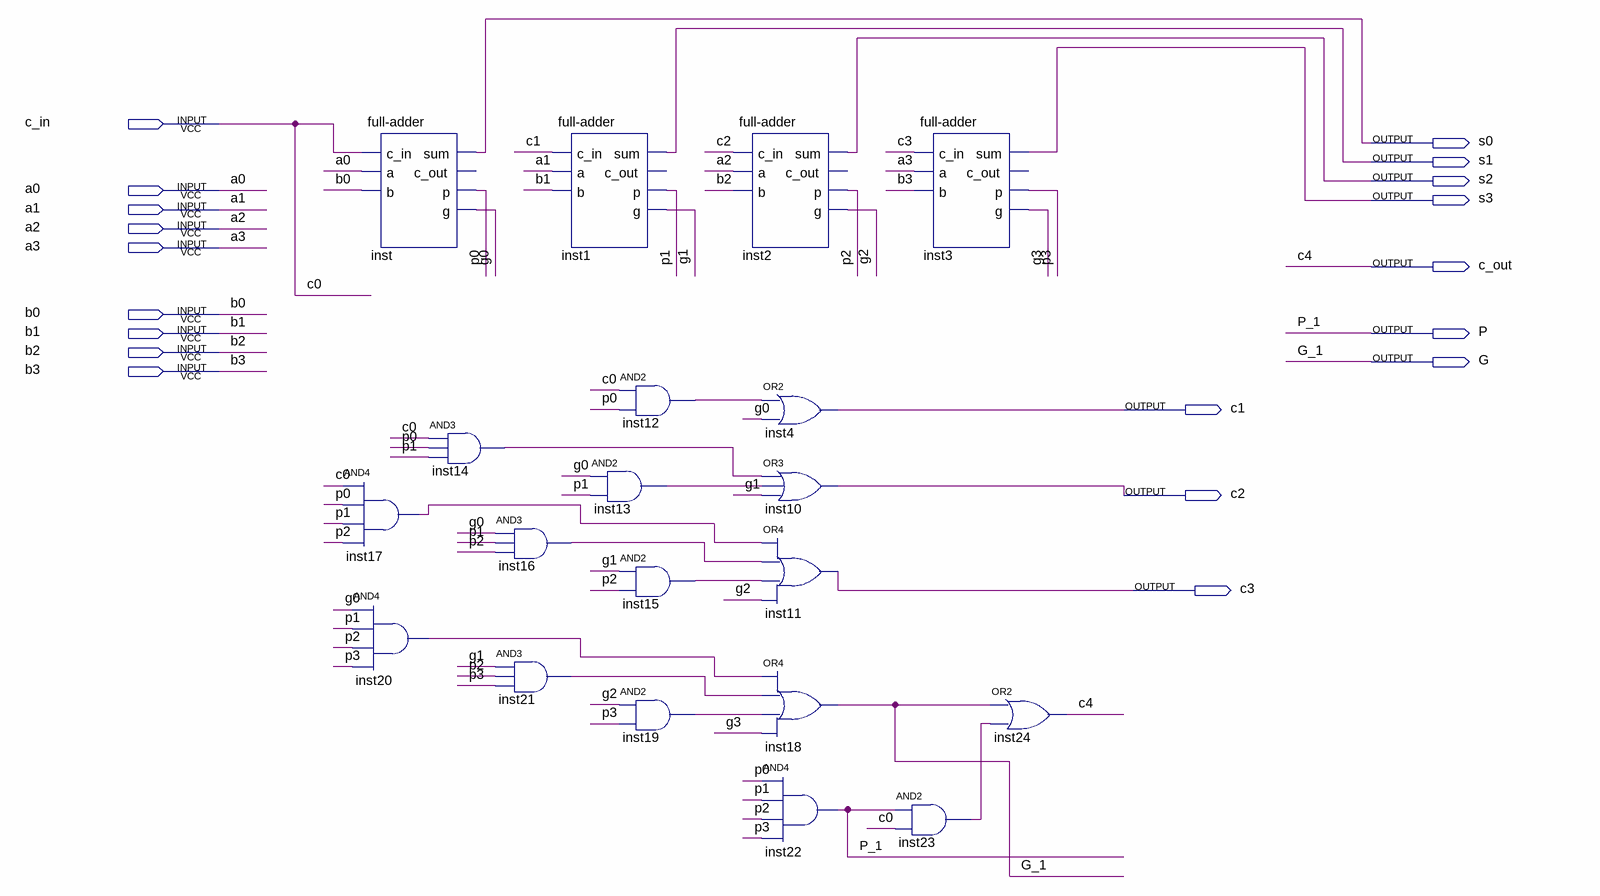
[diagram p0: schematic sheet]
// Quartus schematic Carry_Look_Ahead.bdf as structural Verilog: 20 symbols, 19 pins
module Carry_Look_Ahead (
  input  c_in,
  input  a0,
  input  a1,
  input  a2,
  input  a3,
  input  b0,
  input  b1,
  input  b2,
  input  b3,
  output s0,
  output s1,
  output s2,
  output s3,
  output c_out,
  output P,
  output G,
  output c1,
  output c2,
  output c3
);

  wire g0, g1, g2, g3, inst12_out, inst13_out, inst14_out, inst15_out, inst16_out, inst17_out, inst19_out,
       inst20_out, inst21_out, inst23_out, p0, p1, p2, p3;

  \full-adder  inst (.c_in(c_in), .a(a0), .b(b0), .sum(s0), .p(p0), .g(g0));  // open: c_out
  and inst17 (inst17_out, c_in, p0, p1, p2);
  and inst20 (inst20_out, g0, p1, p2, p3);
  and inst14 (inst14_out, c_in, p0, p1);
  and inst16 (inst16_out, g0, p1, p2);
  and inst21 (inst21_out, g1, p2, p3);
  \full-adder  inst1 (.c_in(c1), .a(a1), .b(b1), .sum(s1), .p(p1), .g(g1));  // open: c_out
  and inst12 (inst12_out, c_in, p0);
  and inst13 (inst13_out, g0, p1);
  and inst15 (inst15_out, g1, p2);
  and inst19 (inst19_out, g2, p3);
  \full-adder  inst2 (.c_in(c2), .a(a2), .b(b2), .sum(s2), .p(p2), .g(g2));  // open: c_out
  or inst4 (c1, inst12_out, g0);
  or inst10 (c2, inst14_out, inst13_out, g1);
  or inst11 (c3, inst17_out, inst16_out, inst15_out, g2);
  or inst18 (G, inst20_out, inst21_out, inst19_out, g3);
  and inst22 (P, p0, p1, p2, p3);
  \full-adder  inst3 (.c_in(c3), .a(a3), .b(b3), .sum(s3), .p(p3), .g(g3));  // open: c_out
  and inst23 (inst23_out, P, c_in);
  or inst24 (c_out, G, inst23_out);

  // Other names for the same wires on the sheet: c4 = c_out; c0 = c_in; G_1 = G; P_1 = P
endmodule
